# EAGLE design Lightbar (EAGLE 9.7.0)
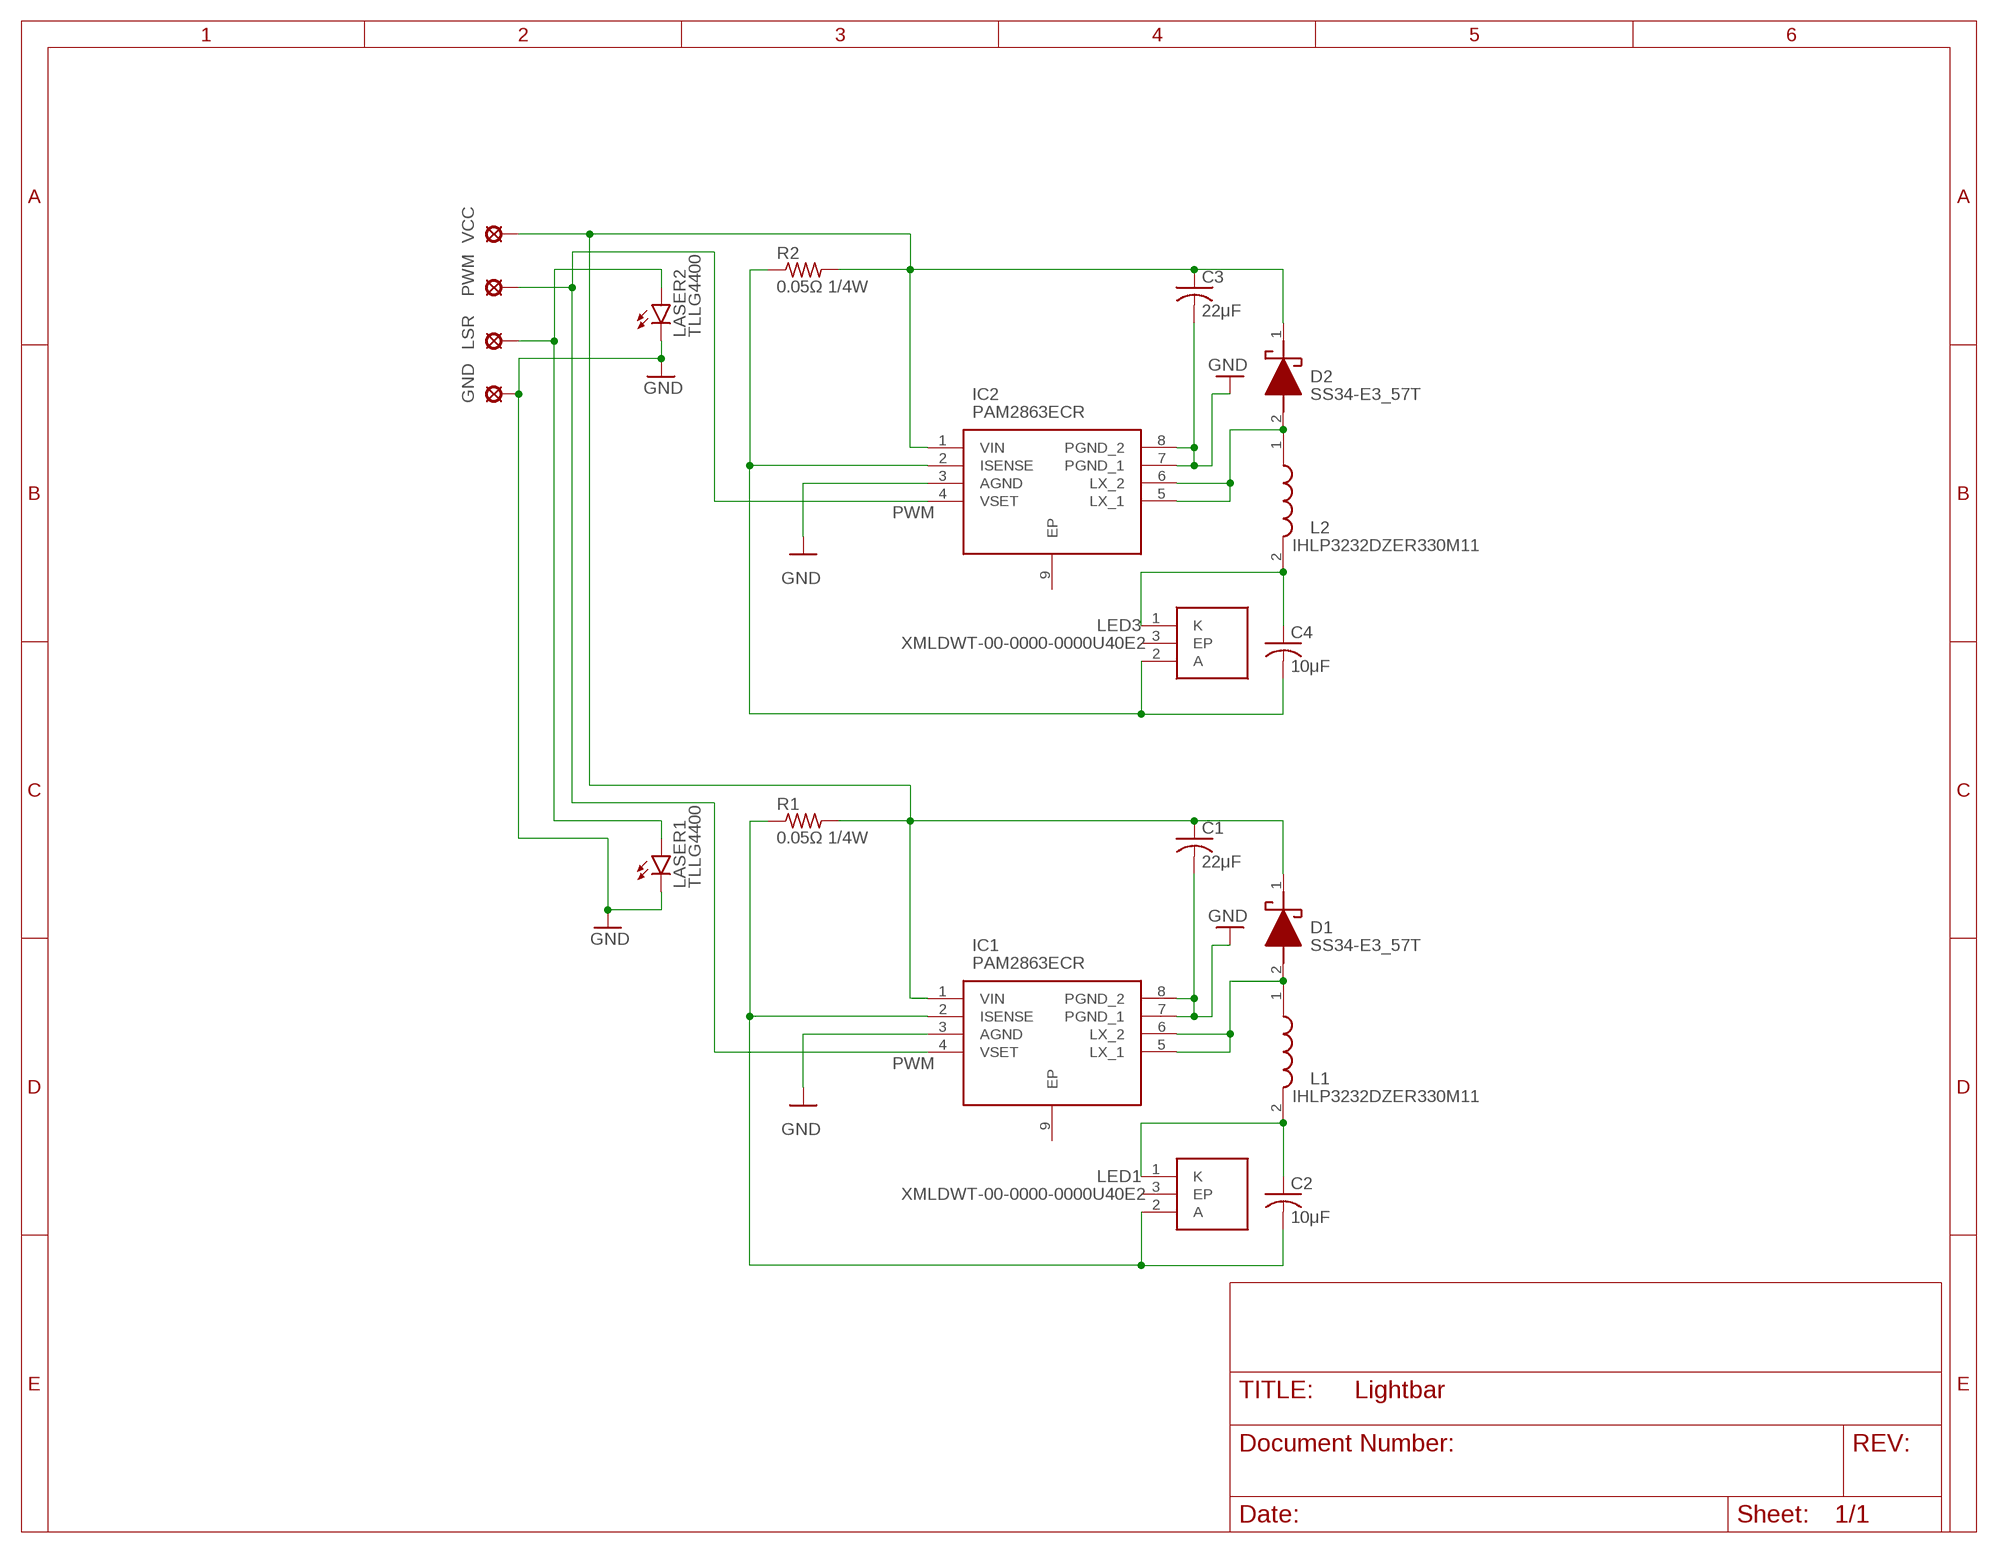
[diagram p0: schematic, sheet 1]

## Parts
C1  22μF  C-USC1210  [C1210]
C2  10μF  C-USC1210  [C1210]
C3  22μF  C-USC1210  [C1210]
C4  10μF  C-USC1210  [C1210]
D1  SS34-E3_57T  [DIOM7959X262N]
D2  SS34-E3_57T  [DIOM7959X262N]
GND  LSP10  [LSP10]
IC1  PAM2863ECR  [SOIC127P600X175-9N]
IC2  PAM2863ECR  [SOIC127P600X175-9N]
L1  IHLP3232DZER330M11  [IHLP3232DZER330M11]
L2  IHLP3232DZER330M11  [IHLP3232DZER330M11]
LASER1  TLLG4400  [LED3MM]
LASER2  TLLG4400  [LED3MM]
LED1  XMLDWT-00-0000-0000U40E2  [XMLDWT0000000000U40E2]
LED3  XMLDWT-00-0000-0000U40E2  [XMLDWT0000000000U40E2]
LSR  LSP10  [LSP10]
PWM  LSP10  [LSP10]
R1  0.05Ω 1/4W  R-US_R0805  [R0805]
R2  0.05Ω 1/4W  R-US_R0805  [R0805]
VCC  LSP10  [LSP10]

## Nets
GND: C1.2 C3.2 GND.MP IC1.3(AGND) IC1.7(PGND_1) IC1.8(PGND_2) IC2.3(AGND) IC2.7(PGND_1) IC2.8(PGND_2) LASER1.K(C) LASER2.K(C)
N$1: C2.1 L1.2 LED1.1(K)
N$3: C2.2 IC1.2(ISENSE) LED1.2(A) R1.1
N$4: C1.1 C3.1 D1.1(K) D2.1(K) IC1.1(VIN) IC2.1(VIN) R1.2 R2.2 VCC.MP
N$5: D1.2(A) IC1.5(LX_1) IC1.6(LX_2) L1.1
N$7: D2.2(A) IC2.5(LX_1) IC2.6(LX_2) L2.1
N$8: C4.1 L2.2 LED3.1(K)
N$9: C4.2 IC2.2(ISENSE) LED3.2(A) R2.1
N$10: LASER1.A LASER2.A LSR.MP
PWM1: IC1.4(VSET) IC2.4(VSET) PWM.MP
Unconnected: IC1.9(EP) IC2.9(EP) LED1.3(EP) LED3.3(EP)

## Notes on the sheet
- PWM
- PWM

## Library data of the parts
C1-C4 = rcl:C-US: CAPACITOR, American symbol; SPICEPREFIX: C
D1 D2 = SS34-E3_57T:SS34-E3_57T: Vishay SS34-E3/57T SMT Schottky Diode, 40V 3A, 2-Pin DO-214AB Source: Datasheet <https://www.vishay.com/docs/88751/ss32.pdf>; DESCRIPTION: Vishay SS34-E3/57T SMT Schottky Diode, 40V 3A, 2-Pin DO-214AB; HEIGHT: 2.62mm; MANUFACTURER_NAME: Vishay; MANUFACTURER_PART_NUMBER: SS34-E3/57T; MOUSER_PART_NUMBER: 625-SS34-E3; MOUSER_PRICE-STOCK: https://www.mouser.co.uk/ProductDetail/Vishay-General-Semiconductor/SS34-E3-57T?qs=x2jpVgRnAtMC3f38kYWnRw%3D%3D
GND LSR PWM VCC = solpad:LSP10: SOLDER PAD drill 1.0 mm, distributor Buerklin, 12H555
IC1 IC2 = PAM2863ECR:PAM2863ECR: Step-down LED Driver 1MHz 40V 2A SOP-8EP DiodesZetex PAM2863ECR LED Driver IC, 4.5 40 V dc 2A 8-Pin SOP Source: Datasheet <https://componentsearchengine.com/Datasheets/1/PAM2863ECR.pdf>; DESCRIPTION: Step-down LED Driver 1MHz 40V 2A SOP-8EP DiodesZetex PAM2863ECR LED Driver IC, 4.5 40 V dc 2A 8-Pin SOP; HEIGHT: 1.75mm; MANUFACTURER_NAME: Diodes Inc.; MANUFACTURER_PART_NUMBER: PAM2863ECR; MOUSER_PART_NUMBER: 621-PAM2863ECR; MOUSER_PRICE-STOCK: https://www.mouser.co.uk/ProductDetail/Diodes-Incorporated/PAM2863ECR?qs=pYVYkI7xuRXLW6Fe66wa3w%3D%3D
L1 L2 = IHLP3232DZER330M11:IHLP3232DZER330M11: VISHAY - IHLP3232DZER330M11 - INDUCTOR, POWER, 33UH, 3.2A, 20% Source: Datasheet <http://www.vishay.com/docs/34313/ihlp3232dz11.pdf>; DESCRIPTION: VISHAY - IHLP3232DZER330M11 - INDUCTOR, POWER, 33UH, 3.2A, 20%; HEIGHT: 4mm; MANUFACTURER_NAME: Vishay; MANUFACTURER_PART_NUMBER: IHLP3232DZER330M11; MOUSER_PART_NUMBER: 70-IHLP3232DZER330M1; MOUSER_PRICE-STOCK: https://www.mouser.co.uk/ProductDetail/Vishay-Dale/IHLP3232DZER330M11?qs=Nbmv7C3%2FzlCWG7z%252BjqZ9qQ%3D%3D
LASER1 LASER2 = led:TLLG4400: Low Current (2mA) LED 3 mm Tinted Diffused Package color GREEN Source: Data sheet <http://www.farnell.com/datasheets/391098.pdf>; MF: VISHAY SEMICONDUCTOR; OC_FARNELL: 1612435
LED1 LED3 = XMLDWT-00-0000-0000U40E2:XMLDWT-00-0000-0000U40E2: High Power LEDs - White White 5700K 340lm Source: Datasheet; DESCRIPTION: High Power LEDs - White White 5700K 340lm; HEIGHT: 3.02mm; MANUFACTURER_NAME: CREE LED; MANUFACTURER_PART_NUMBER: XMLDWT-00-0000-0000U40E2; MOUSER_PART_NUMBER: 941-XMLDWT0000U40E2; MOUSER_PRICE-STOCK: https://www.mouser.co.uk/ProductDetail/Cree-Inc/XMLDWT-00-0000-0000U40E2?qs=OlC7AqGiEDlKbRHig9Whrw%3D%3D
R1 R2 = rcl:R-US_: RESISTOR, American symbol; SPICEPREFIX: R

## Board
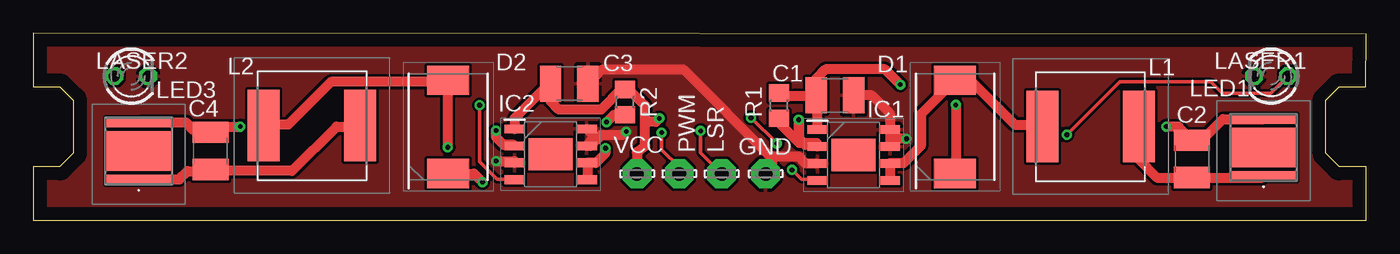
[diagram p1: board, top side]
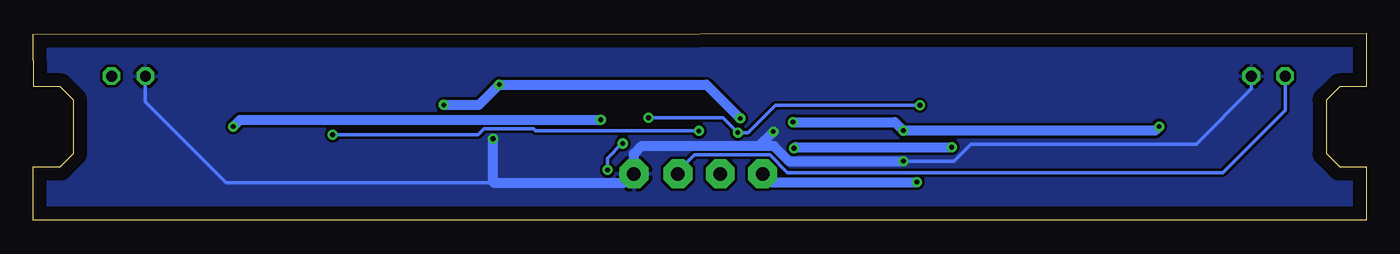
[diagram p2: board, bottom side, seen from below]

Size 100.02 x 14.03 mm. Coordinates in mm from the lower left corner, seen from the top.
Outline: 0,0.02 100.02,0 100.02,4.01 98,4.02 97,5.02 97,9.02 98,10.02 100,10.02 100.02,13.96 0.01,14.03 0,10.02 2,10.02 3,9.02 3,5.02 2,4.02 0,4.02 0,0.02
Copper layers (1*16): Top 0.035mm / dielectric 1.5mm / Bottom 0.035mm
Design rules "default": minimum track width 6mil, minimum drill 0.35mm, track to track 6mil, track to pad 6mil, pad to pad 6mil, via to via 6mil, smd to smd 6mil, copper to edge 40mil, drill to drill 6mil, minimum pad ring 10mil, minimum via ring 8mil, stop-mask expansion 4mil, vias tented up to drill 0mil, thermal gap 10mil

### Footprints (pad centres in the part's own frame; a part is rotated, then mirrored left to right if it is on the bottom)
C1210 = smd 1.6 x 2.7: 1 -1.4,0; 2 1.4,0
DIOM7959X262N = smd 2.2 x 3.15: 1 -3.5,0; 2 3.5,0
LSP10 = drill 1.016 pad 2.159 octagon: MP 0,0
SOIC127P600X175-9N = smd 1.525 x 0.65: 1 -2.712,1.905; 2 -2.712,0.635; 3 -2.712,-0.635; 4 -2.712,-1.905; 5 2.712,-1.905; 6 2.712,-0.635; 7 2.712,0.635; 8 2.712,1.905 | smd 3.3 x 2.41: 9 0,0
IHLP3232DZER330M11 = smd 2.413 x 5.334: 1 -3.619,0; 2 3.619,0
LED3MM = drill 0.813 octagon: A -1.27,0; K 1.27,0
XMLDWT0000000000U40E2 = smd 0.7 x 4.98: 1 -2.14,0; 2 2.14,0 | smd 2.98 x 4.98: 3 0,0
R0805 = smd 1.3 x 1.5: 1 -0.95,0; 2 0.95,0

### Placement (x,y rotation side)
C1  60.16,9.37 0 top
C2  86.95,4.61 90 top
C3  40.22,10.26 0 top
C4  13.29,5.21 90 top
D1  69.17,7.01 90 top
D2  31.13,7.01 90 top
GND  54.95,3.49 0 top
IC1  61.55,4.9 0 top
IC2  38.82,4.95 0 top
L1  79.33,7.04 0 top
L2  20.91,7.11 0 top
LASER1  92.88,10.82 180 top
LASER2  7.35,10.82 0 top
LED1  92.32,5.46 90 top
LED3  7.91,5.21 90 top
LSR  51.65,3.49 0 top
PWM  48.47,3.49 0 top
R1  55.97,8.61 90 top
R2  44.41,8.87 90 top
VCC  45.3,3.49 0 top

### Tracks (layer width: path | path; a pad name or v marks a point on that pad's centre or on a via)
GND  (via drill 0.35)
  Top 0.152: 64.3,5.66 IC1.7 | 64.3,6.73 IC1.8 | GND.MP
  Top 0.762: 64.3,6.73 64.3,6.12 | 64.3,6.12 64.3,5.66 | IC1.8 64.27,8.03 62.93,9.37 C1.2 | IC2.8 42.08,6.32 IC2.7 41.79,5.59 42.6,6.4 44.23,6.4 v44.49,6.66 | IC1.3 57.95,4.26 57.44,4.78 55.33,4.78 | v34.73,4.45 36.1,4.45 IC2.3 | 55.33,4.78 55.46,4.65 55.46,4 GND.MP | 55.33,4.78 48.83,11.28 42.65,11.28 41.68,10.26 C3.2 | v65.52,6.12 64.3,6.12
  Bottom 0.152: 44.41,5.59 44.44,5.56
  Bottom 0.254: LASER2.K 8.62,9.86 12.76,5.72 29.65,5.72 30.92,4.45 v34.73,4.45 | LASER1.K 91.61,8.9 85.53,2.82 65.52,2.82
  Bottom 0.762: v34.73,4.45 43.32,4.45 44.44,5.56 | 45.55,5.59 54.37,5.59 54.95,5 GND.MP 55.62,2.82 65.52,2.82 v65.52,6.12 | 45.55,5.59 44.41,5.59 | 45.55,5.59 v44.49,6.66
  pour Top (isolate 0.2): 0,14.02 0,10.02 2,10.02 3,9.02 3,5.02 2,4.02 0,4.02 0,0.02 100,0.02 100,4.02 98,4.02 97,5.02 97,9.02 98,10.02 100,10.02 100,14.02
  pour Bottom (isolate 0.2): 0,14.02 0,10.02 2,10.02 3,9.02 3,5.02 2,4.02 0,4.02 0,0.02 100,0.02 100,4.02 98,4.02 97,5.02 97,9.02 98,10.02 100,10.02 100,14.02
N$1
  Top 0.152: L1.2 82.95,4.59 | 92.21,3.21 LED1.1
  Top 0.762: 82.95,4.59 84.33,3.21 C2.1 92.21,3.21
N$3  (via drill 0.35)
  Top 0.152: 58.78,5.79 IC1.2
  Top 0.762: R1.1 55.97,7.32 57.49,5.79 58.78,5.79 | IC1.2 58.72,5.66 57.93,5.66 57.44,6.15 v57.44,7.54 | v85.03,7.04 85.94,7.04 86.85,6.12 C2.2 87.01,6.12 87.79,6.12 89.27,7.6 LED1.2
  Bottom 0.762: v85.03,7.04 84.52,7.54 v57.44,7.54
N$4  (via drill 0.35)
  Top 0.152: C1.1 58.76,10.64 | 58.81,6.88 IC1.1 | 58.81,9.17 58.81,9.32 C1.1 | C1.1 58.7,9.31 58.67,9.31
  Top 0.762: 58.67,9.31 56.22,9.31 R1.2 | 58.81,9.17 58.81,6.88 | 58.76,10.64 59.45,11.33 63.92,11.33 v65.06,10.19 | v69.23,8.66 69.23,3.56 D1.1 | IC2.1 36.13,6.86 36.13,7.67 38.7,10.24 C3.1 38.82,8.92 39.43,8.31 42.61,8.31 44.12,9.82 R2.2 44.66,9.82 44.68,9.8 44.75,9.77 45.91,8.61 45.91,7.39 | 45.91,7.39 45.91,5.57 45.3,5.11 VCC.MP | D2.1 33.07,3.51 v33.72,2.87 | 45.91,7.39 46.72,7.39 v46.98,7.65
  Bottom 0.762: v69.23,8.66 66.58,8.66 v65.06,10.19 49.52,10.19 v46.98,7.65 | VCC.MP 44.68,2.87 v33.72,2.87
N$5
  Top 0.152: 64.3,3.07 IC1.5 | 64.3,4.14 IC1.6 64.3,4.29 | 75.58,7.19 L1.1
  Top 0.762: 64.3,4.14 64.3,3.07 | 64.3,4.29 65.31,4.29 66.61,5.59 66.61,7.95 D1.2 70.32,10.51 73.64,7.19 75.58,7.19
N$7  (via drill 0.35)
  Top 0.152: 41.59,3.07 IC2.5 | 41.59,4.29 IC2.6 | 31.1,10.48 D2.2 31.07,10.39 | 17.36,7.19 L2.1
  Top 0.762: 41.59,4.29 41.59,3.07 | v42.94,5.41 42.94,5.03 42.23,4.32 IC2.6 | 31.1,10.48 v31.1,5.49 | 17.36,7.19 19.14,7.19 22.34,10.39 31.07,10.39
  Bottom 0.762: v31.1,5.49 42.86,5.49 v42.94,5.41
N$8
  Top 0.152: 13.24,3.68 C4.1 | 8.06,3.07 LED3.1 | 24.52,7.04 L2.2
  Top 0.762: 13.24,3.68 11.57,3.68 10.96,3.07 8.06,3.07 | 24.52,7.04 22.74,7.04 19.42,3.71 13.39,3.71 C4.1
N$9  (via drill 0.35)
  Top 0.152: IC2.2 36.08,5.62 36.08,5.66 | 13.24,6.73 C4.2 | 8.06,7.34 LED3.2
  Top 0.762: R2.1 43.56,7.92 v43.01,7.37 | v34.73,6.73 34.73,6.22 35.29,5.66 36.08,5.66 | 13.24,6.73 12.08,6.73 11.47,7.34 8.06,7.34 | v15.53,7.04 13.7,7.04 13.4,6.73 C4.2
  Bottom 0.762: v43.01,7.37 35.37,7.37 v34.73,6.73 15.84,6.73 v15.53,7.04
N$10  (via drill 0.35)
  Top 0.254: LSR.MP 50.07,5.07 v50.07,6.71 | LASER1.A 92.88,9.55 92.88,9.53 89.24,9.53 88.38,10.39 81.52,10.39 v77.56,6.43
  Bottom 0.152: LSR.MP 51.65,3.66
  Bottom 0.254: LASER2.A 6.08,8.26 10.76,3.58 43.42,3.58 44.74,4.9 50.4,4.9 51.65,3.66 | v77.56,6.43 66.64,6.43 66.2,6.86 62.49,6.86 62.34,6.71 v50.07,6.71
PWM1  (via drill 0.35)
  Top 0.152: 36.1,3.07 IC2.4
  Top 0.254: 36.1,3.07 34.81,3.07 33.49,4.39 v33.49,8.64 | v47.15,6.58 47.15,5.31 48.47,3.99 PWM.MP | v56.93,3.79 57.64,3.07 58.81,3.07 IC1.4 | v55.79,5.77 v53.86,7.7
  Bottom 0.152: v55.79,5.77 55.84,5.77
  Bottom 0.254: v33.49,8.64 44.33,8.64 46.39,6.58 v47.15,6.58 48.27,7.7 v53.86,7.7 | 55.84,5.77 56.93,4.67 v56.93,3.79